# Altium schematic sheet 06_8MPLUS_IO.SchDoc: 8MPLUS_IO
size 420 x 297 mm; Author: Lukas Henkel; DocumentNumber: 6; SheetNumber: 6; SheetTotal: 16; DocSize: A3
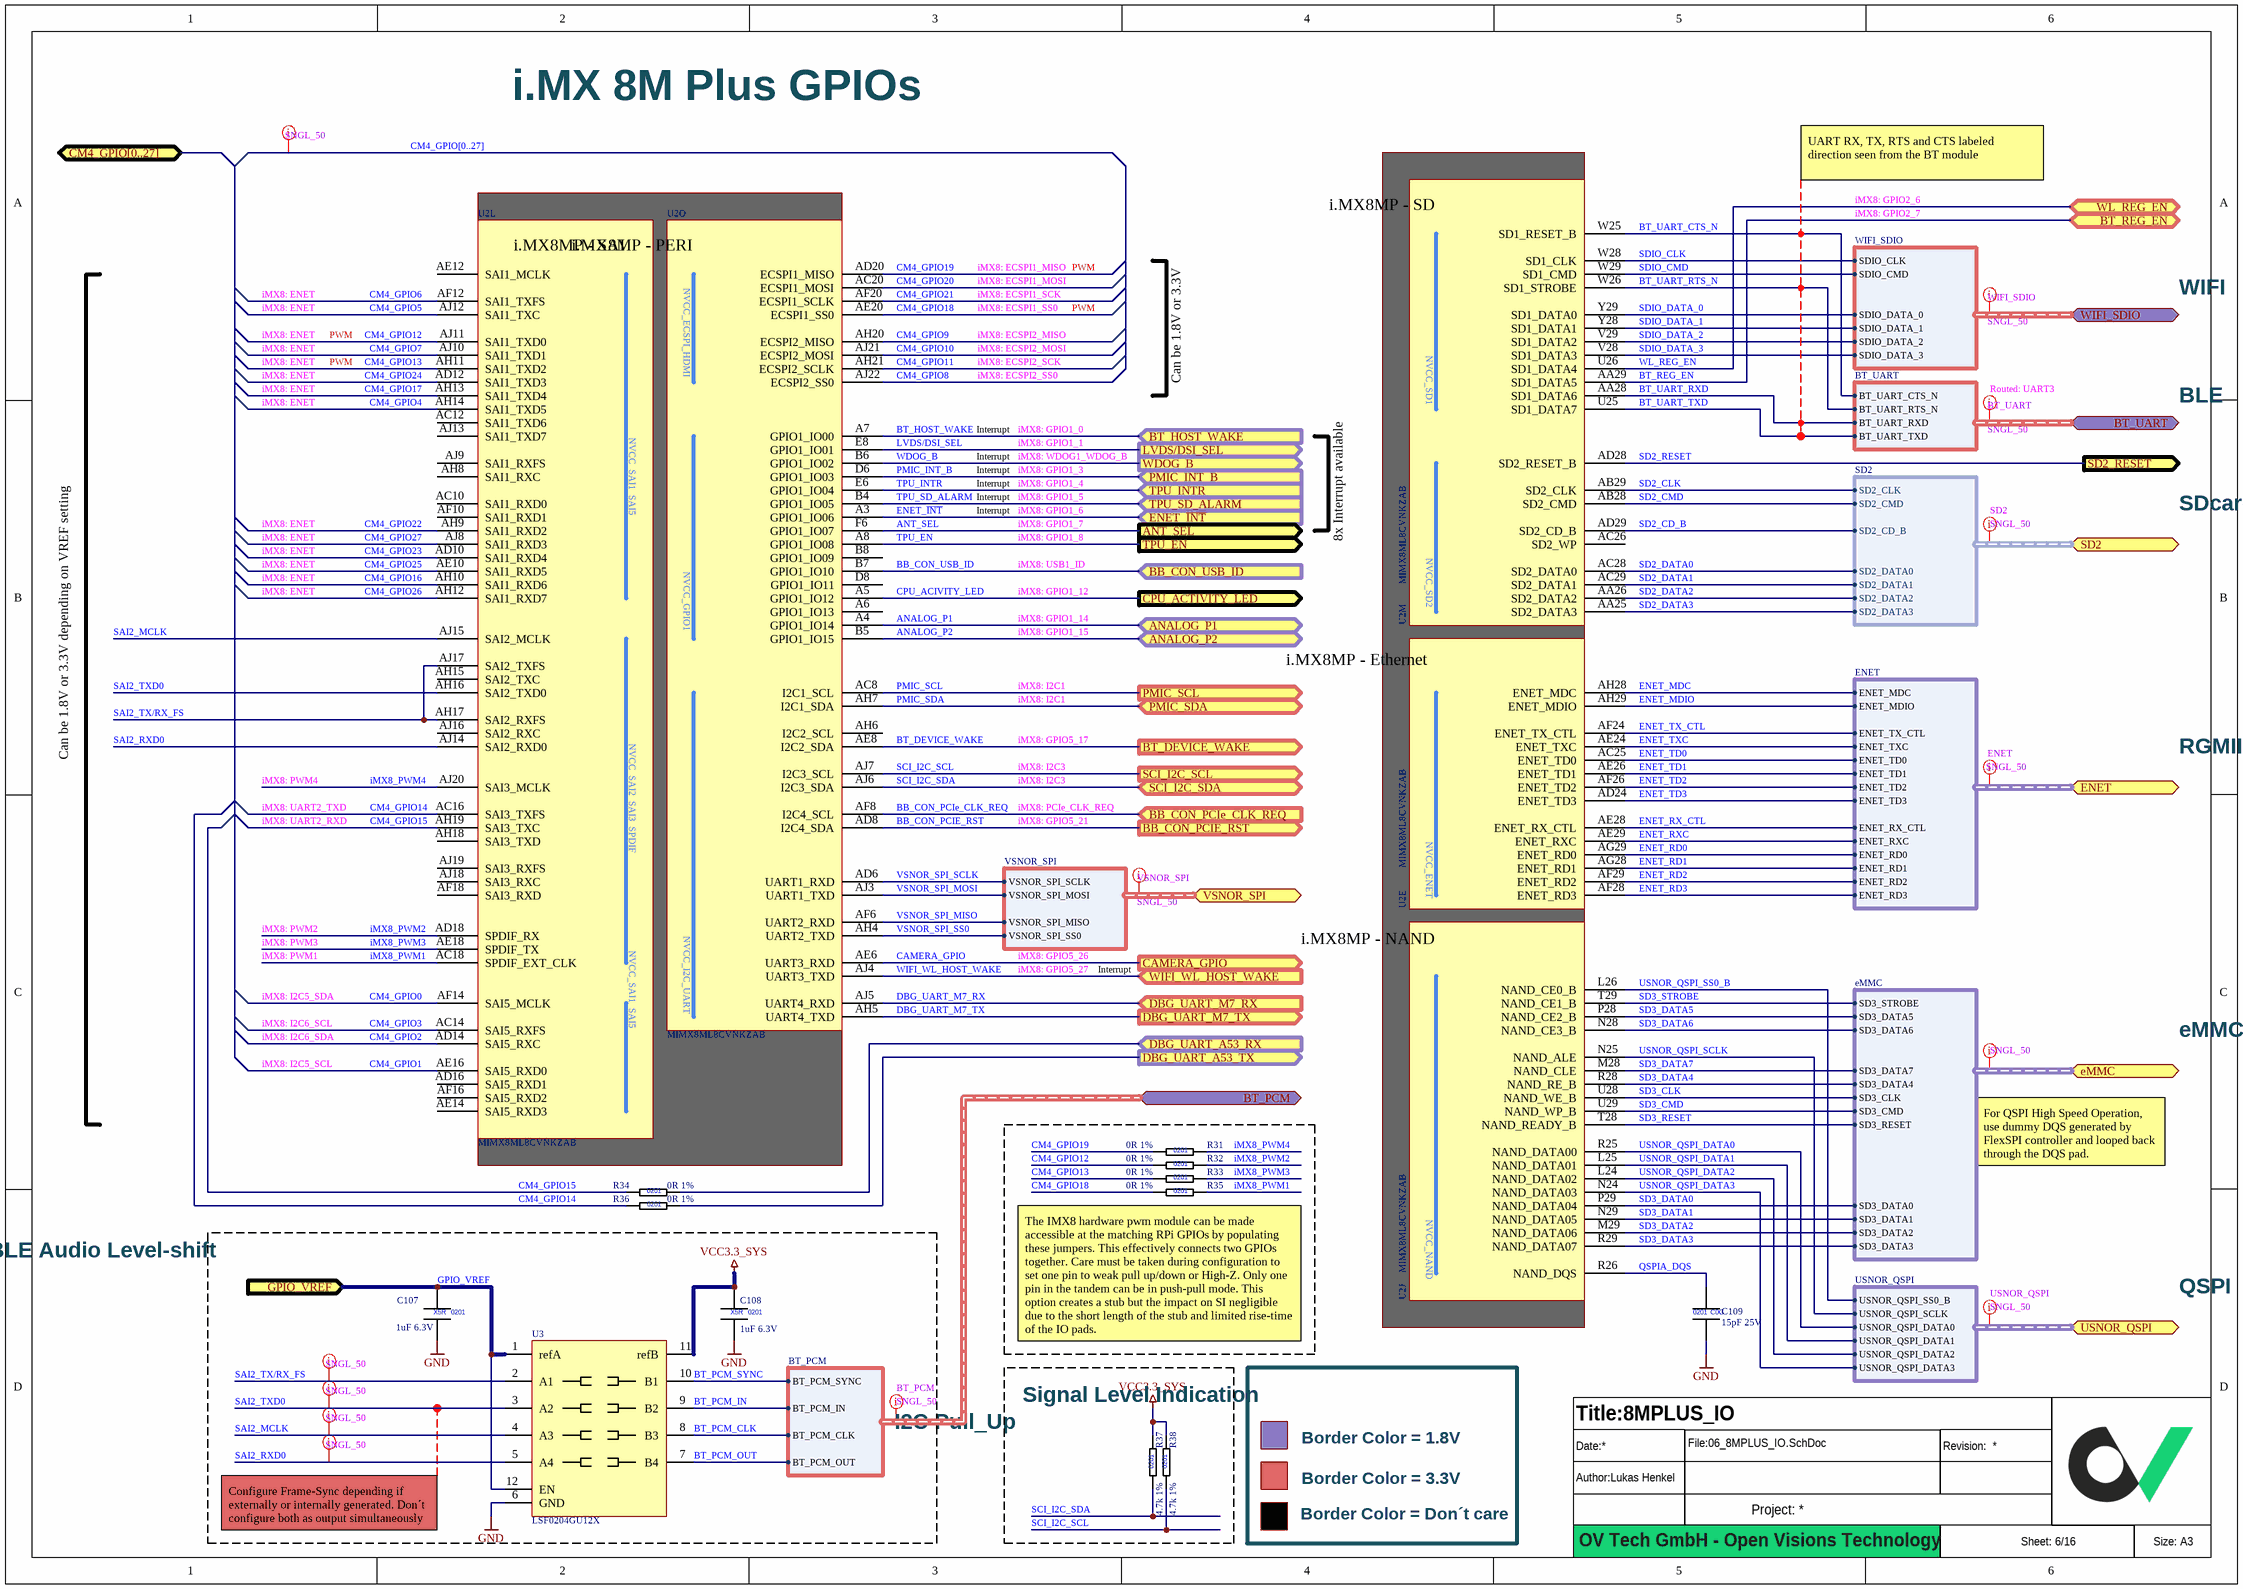
[diagram p0: 06_8MPLUS_IO.SchDoc]

## Parts
?  (no value)  (graphical)
C107  1uF 6.3V  [CAPC0603X03L]
C108  1uF 6.3V  [CAPC0603X03L]
C109  15pF 25V  [CAPC0603X03L]
R31  0R 1%  [RESC0603X03L]
R32  0R 1%  [RESC0603X03L]
R33  0R 1%  [RESC0603X03L]
R34  0R 1%  [RESC0603X03L]
R35  0R 1%  [RESC0603X03L]
R36  0R 1%  [RESC0603X03L]
R37  4.7k 1%  [RESC0603X03L]
R38  4.7k 1%  [RESC0603X03L]
U2  MIMX8ML8CVNKZAB  [BGA548C50P29X29_1500X1500X148]  (parts E,J,L,M,O of 15)
U3  LSF0204GU12X  [QFN40P170X200X50-12L]

## Blocks framed on the sheet
BLE Audio Level-shift: C107 C108 U3
I2C Pull_Up: R37 R38

## Ports
ANALOG_P1 (bidir), ANALOG_P2 (bidir), ANT_SEL (out), BB_CON_PCIe_CLK_REQ (in), BB_CON_PCIE_RST (out), BB_CON_USB_ID (in), BT_DEVICE_WAKE (out), BT_HOST_WAKE (in), BT_PCM (bidir, harness BT_PCM), BT_REG_EN (bidir), BT_UART (bidir, harness BT_UART), CAMERA_GPIO (out), CM4_GPIO[0..27] (bidir), CPU_ACTIVITY_LED (out), DBG_UART_A53_RX (in), DBG_UART_A53_TX (out), DBG_UART_M7_RX (in), DBG_UART_M7_TX (out), eMMC (bidir, harness eMMC), ENET (bidir, harness ENET), ENET_~{INT} (in), GPIO_VREF (in), LVDS/DSI_SEL (out), PMIC_INT_B (in), PMIC_SCL (out), PMIC_SDA (bidir), SCI_I2C_SCL (out), SCI_I2C_SDA (bidir), SD2 (bidir, harness SD2), SD2_RESET (out), TPU_EN (out), TPU_INTR (in), TPU_SD_ALARM (in), USNOR_QSPI (bidir, harness USNOR_QSPI), VSNOR_SPI (bidir, harness VSNOR_SPI), WDOG_B (out), WIFI_SDIO (bidir, harness WIFI_SDIO), WIFI_WL_HOST_WAKE (in), WL_REG_EN (bidir)

## Harnesses
ENET: ENET_MDC, ENET_MDIO, ENET_TX_CTL, ENET_TXC, ENET_TD0, ENET_TD1, ENET_TD2, ENET_TD3, ENET_RX_CTL, ENET_RXC, ENET_RD0, ENET_RD1, ENET_RD2, ENET_RD3
SD2: SD2_CLK, SD2_CMD, SD2_CD_B, SD2_DATA0, SD2_DATA1, SD2_DATA2, SD2_DATA3
WIFI_SDIO: SDIO_DATA_1, SDIO_DATA_0, SDIO_DATA_3, SDIO_DATA_2, SDIO_CMD, SDIO_CLK
BT_UART: BT_UART_TXD, BT_UART_RXD, BT_UART_RTS_N, BT_UART_CTS_N
BT_PCM: BT_PCM_SYNC, BT_PCM_IN, BT_PCM_OUT, BT_PCM_CLK
eMMC: SD3_STROBE, SD3_CLK, SD3_CMD, SD3_DATA0, SD3_DATA1, SD3_DATA2, SD3_DATA3, SD3_DATA4, SD3_DATA5, SD3_DATA6, SD3_DATA7, SD3_RESET
USNOR_QSPI: USNOR_QSPI_SCLK, USNOR_QSPI_SS0_B, USNOR_QSPI_DATA0, USNOR_QSPI_DATA1, USNOR_QSPI_DATA2, USNOR_QSPI_DATA3
VSNOR_SPI: VSNOR_SPI_SS0, VSNOR_SPI_SCLK, VSNOR_SPI_MOSI, VSNOR_SPI_MISO

## Nets
GND: C107.2 C108.2 C109.2 U3.6(GND)
VCC3.3_SYS: C108.1 R37.2 R38.2 U3.11(refB)
ANALOG_P1: U2.A4(GPIO1_IO14) ; port ANALOG_P1
ANALOG_P2: U2.B5(GPIO1_IO15) ; port ANALOG_P2
ANT_SEL: U2.F6(GPIO1_IO07) ; port ANT_SEL
BB_CON_PCIe_CLK_REQ: U2.AF8(I2C4_SCL) ; port BB_CON_PCIe_CLK_REQ
BB_CON_PCIE_RST: U2.AD8(I2C4_SDA) ; port BB_CON_PCIE_RST
BB_CON_USB_ID: U2.B7(GPIO1_IO10) ; port BB_CON_USB_ID
BT_DEVICE_WAKE: U2.AE8(I2C2_SDA) ; port BT_DEVICE_WAKE
BT_HOST_WAKE: U2.A7(GPIO1_IO00) ; port BT_HOST_WAKE
BT_PCM_CLK: U3.8(B3) ; port BT_PCM.BT_PCM_CLK
BT_PCM_IN: U3.9(B2) ; port BT_PCM.BT_PCM_IN
BT_PCM_OUT: U3.7(B4) ; port BT_PCM.BT_PCM_OUT
BT_PCM_SYNC: U3.10(B1) ; port BT_PCM.BT_PCM_SYNC
BT_REG_EN: U2.AA29(SD1_DATA5) ; port BT_REG_EN
BT_UART_CTS_N: U2.W25(SD1_RESET_B) ; port BT_UART.BT_UART_CTS_N
BT_UART_RTS_N: U2.W26(SD1_STROBE) ; port BT_UART.BT_UART_RTS_N
BT_UART_RXD: U2.AA28(SD1_DATA6) ; port BT_UART.BT_UART_RXD
BT_UART_TXD: U2.U25(SD1_DATA7) ; port BT_UART.BT_UART_TXD
CAMERA_GPIO: U2.AE6(UART3_RXD) ; port CAMERA_GPIO
CM4_GPIO0: U2.AF14(SAI5_MCLK)
CM4_GPIO1: U2.AE16(SAI5_RXD0)
CM4_GPIO2: U2.AD14(SAI5_RXC)
CM4_GPIO3: U2.AC14(SAI5_RXFS)
CM4_GPIO4: U2.AH14(SAI1_TXD5)
CM4_GPIO5: U2.AJ12(SAI1_TXC)
CM4_GPIO6: U2.AF12(SAI1_TXFS)
CM4_GPIO7: U2.AJ10(SAI1_TXD1)
CM4_GPIO8: U2.AJ22(ECSPI2_SS0)
CM4_GPIO9: U2.AH20(ECSPI2_MISO)
CM4_GPIO10: U2.AJ21(ECSPI2_MOSI)
CM4_GPIO11: U2.AH21(ECSPI2_SCLK)
CM4_GPIO12: R32.1 U2.AJ11(SAI1_TXD0)
CM4_GPIO13: R33.1 U2.AH11(SAI1_TXD2)
CM4_GPIO14: R36.1 U2.AC16(SAI3_TXFS)
CM4_GPIO15: R34.1 U2.AH19(SAI3_TXC)
CM4_GPIO16: U2.AH10(SAI1_RXD6)
CM4_GPIO17: U2.AH13(SAI1_TXD4)
CM4_GPIO18: R35.1 U2.AE20(ECSPI1_SS0)
CM4_GPIO19: R31.1 U2.AD20(ECSPI1_MISO)
CM4_GPIO20: U2.AC20(ECSPI1_MOSI)
CM4_GPIO21: U2.AF20(ECSPI1_SCLK)
CM4_GPIO22: U2.AH9(SAI1_RXD2)
CM4_GPIO23: U2.AD10(SAI1_RXD4)
CM4_GPIO24: U2.AD12(SAI1_TXD3)
CM4_GPIO25: U2.AE10(SAI1_RXD5)
CM4_GPIO26: U2.AH12(SAI1_RXD7)
CM4_GPIO27: U2.AJ8(SAI1_RXD3)
CPU_ACIVITY_LED: U2.A5(GPIO1_IO12) ; port CPU_ACTIVITY_LED
DBG_UART_A53_RX: R34.2 ; port DBG_UART_A53_RX
DBG_UART_A53_TX: R36.2 ; port DBG_UART_A53_TX
DBG_UART_M7_RX: U2.AJ5(UART4_RXD) ; port DBG_UART_M7_RX
DBG_UART_M7_TX: U2.AH5(UART4_TXD) ; port DBG_UART_M7_TX
ENET_~{INT}: U2.A3(GPIO1_IO06) ; port ENET_~{INT}
ENET_MDC: U2.AH28(ENET_MDC) ; port ENET.ENET_MDC
ENET_MDIO: U2.AH29(ENET_MDIO) ; port ENET.ENET_MDIO
ENET_RD0: U2.AG29(ENET_RD0) ; port ENET.ENET_RD0
ENET_RD1: U2.AG28(ENET_RD1) ; port ENET.ENET_RD1
ENET_RD2: U2.AF29(ENET_RD2) ; port ENET.ENET_RD2
ENET_RD3: U2.AF28(ENET_RD3) ; port ENET.ENET_RD3
ENET_RX_CTL: U2.AE28(ENET_RX_CTL) ; port ENET.ENET_RX_CTL
ENET_RXC: U2.AE29(ENET_RXC) ; port ENET.ENET_RXC
ENET_TD0: U2.AC25(ENET_TD0) ; port ENET.ENET_TD0
ENET_TD1: U2.AE26(ENET_TD1) ; port ENET.ENET_TD1
ENET_TD2: U2.AF26(ENET_TD2) ; port ENET.ENET_TD2
ENET_TD3: U2.AD24(ENET_TD3) ; port ENET.ENET_TD3
ENET_TX_CTL: U2.AF24(ENET_TX_CTL) ; port ENET.ENET_TX_CTL
ENET_TXC: U2.AE24(ENET_TXC) ; port ENET.ENET_TXC
GPIO_VREF: C107.1 U3.1(refA) U3.12(EN) ; port GPIO_VREF
iMX8_PWM1: R35.2 U2.AC18(SPDIF_EXT_CLK)
iMX8_PWM2: R32.2 U2.AD18(SPDIF_RX)
iMX8_PWM3: R33.2 U2.AE18(SPDIF_TX)
iMX8_PWM4: R31.2 U2.AJ20(SAI3_MCLK)
LVDS/DSI_SEL: U2.E8(GPIO1_IO01) ; port LVDS/DSI_SEL
PMIC_INT_B: U2.D6(GPIO1_IO03) ; port PMIC_INT_B
PMIC_SCL: U2.AC8(I2C1_SCL) ; port PMIC_SCL
PMIC_SDA: U2.AH7(I2C1_SDA) ; port PMIC_SDA
QSPIA_DQS: C109.1 U2.R26(NAND_DQS)
SAI2_MCLK: U2.AJ15(SAI2_MCLK) U3.4(A3)
SAI2_RXD0: U2.AJ14(SAI2_RXD0) U3.5(A4)
SAI2_TX/RX_FS: U2.AH17(SAI2_RXFS) U2.AJ17(SAI2_TXFS) U3.2(A1)
SAI2_TXD0: U2.AH16(SAI2_TXD0) U3.3(A2)
SCI_I2C_SCL: R38.1 U2.AJ7(I2C3_SCL) ; port SCI_I2C_SCL
SCI_I2C_SDA: R37.1 U2.AJ6(I2C3_SDA) ; port SCI_I2C_SDA
SD2_CD_B: U2.AD29(SD2_CD_B) ; port SD2.SD2_CD_B
SD2_CLK: U2.AB29(SD2_CLK) ; port SD2.SD2_CLK
SD2_CMD: U2.AB28(SD2_CMD) ; port SD2.SD2_CMD
SD2_DATA0: U2.AC28(SD2_DATA0) ; port SD2.SD2_DATA0
SD2_DATA1: U2.AC29(SD2_DATA1) ; port SD2.SD2_DATA1
SD2_DATA2: U2.AA26(SD2_DATA2) ; port SD2.SD2_DATA2
SD2_DATA3: U2.AA25(SD2_DATA3) ; port SD2.SD2_DATA3
SD2_RESET: U2.AD28(SD2_RESET_B) ; port SD2_RESET
SD3_CLK: U2.U28(NAND_WE_B) ; port eMMC.SD3_CLK
SD3_CMD: U2.U29(NAND_WP_B) ; port eMMC.SD3_CMD
SD3_DATA0: U2.P29(NAND_DATA04) ; port eMMC.SD3_DATA0
SD3_DATA1: U2.N29(NAND_DATA05) ; port eMMC.SD3_DATA1
SD3_DATA2: U2.M29(NAND_DATA06) ; port eMMC.SD3_DATA2
SD3_DATA3: U2.R29(NAND_DATA07) ; port eMMC.SD3_DATA3
SD3_DATA4: U2.R28(NAND_RE_B) ; port eMMC.SD3_DATA4
SD3_DATA5: U2.P28(NAND_CE2_B) ; port eMMC.SD3_DATA5
SD3_DATA6: U2.N28(NAND_CE3_B) ; port eMMC.SD3_DATA6
SD3_DATA7: U2.M28(NAND_CLE) ; port eMMC.SD3_DATA7
SD3_RESET: U2.T28(NAND_READY_B) ; port eMMC.SD3_RESET
SD3_STROBE: U2.T29(NAND_CE1_B) ; port eMMC.SD3_STROBE
SDIO_CLK: U2.W28(SD1_CLK) ; port WIFI_SDIO.SDIO_CLK
SDIO_CMD: U2.W29(SD1_CMD) ; port WIFI_SDIO.SDIO_CMD
SDIO_DATA_0: U2.Y29(SD1_DATA0) ; port WIFI_SDIO.SDIO_DATA_0
SDIO_DATA_1: U2.Y28(SD1_DATA1) ; port WIFI_SDIO.SDIO_DATA_1
SDIO_DATA_2: U2.V29(SD1_DATA2) ; port WIFI_SDIO.SDIO_DATA_2
SDIO_DATA_3: U2.V28(SD1_DATA3) ; port WIFI_SDIO.SDIO_DATA_3
TPU_EN: U2.A8(GPIO1_IO08) ; port TPU_EN
TPU_INTR: U2.E6(GPIO1_IO04) ; port TPU_INTR
TPU_SD_ALARM: U2.B4(GPIO1_IO05) ; port TPU_SD_ALARM
USNOR_QSPI_DATA0: U2.R25(NAND_DATA00) ; port USNOR_QSPI.USNOR_QSPI_DATA0
USNOR_QSPI_DATA1: U2.L25(NAND_DATA01) ; port USNOR_QSPI.USNOR_QSPI_DATA1
USNOR_QSPI_DATA2: U2.L24(NAND_DATA02) ; port USNOR_QSPI.USNOR_QSPI_DATA2
USNOR_QSPI_DATA3: U2.N24(NAND_DATA03) ; port USNOR_QSPI.USNOR_QSPI_DATA3
USNOR_QSPI_SCLK: U2.N25(NAND_ALE) ; port USNOR_QSPI.USNOR_QSPI_SCLK
USNOR_QSPI_SS0_B: U2.L26(NAND_CE0_B) ; port USNOR_QSPI.USNOR_QSPI_SS0_B
VSNOR_SPI_MISO: U2.AF6(UART2_RXD) ; port VSNOR_SPI.VSNOR_SPI_MISO
VSNOR_SPI_MOSI: U2.AJ3(UART1_TXD) ; port VSNOR_SPI.VSNOR_SPI_MOSI
VSNOR_SPI_SCLK: U2.AD6(UART1_RXD) ; port VSNOR_SPI.VSNOR_SPI_SCLK
VSNOR_SPI_SS0: U2.AH4(UART2_TXD) ; port VSNOR_SPI.VSNOR_SPI_SS0
WDOG_B: U2.B6(GPIO1_IO02) ; port WDOG_B
WIFI_WL_HOST_WAKE: U2.AJ4(UART3_TXD) ; port WIFI_WL_HOST_WAKE
WL_REG_EN: U2.U26(SD1_DATA4) ; port WL_REG_EN

Not connected (* = marked no-connect by the designer): U2 A6(GPIO1_IO13) AC10(SAI1_RXD0) AC12(SAI1_TXD6) AC26(SD2_WP) AD16(SAI5_RXD1) AE12(SAI1_MCLK) AE14(SAI5_RXD3) AF10(SAI1_RXD1) AF16(SAI5_RXD2) AF18(SAI3_RXD) AH6(I2C2_SCL) AH8(SAI1_RXC) AH15(SAI2_TXC) AH18(SAI3_TXD) AJ9(SAI1_RXFS) AJ13(SAI1_TXD7) AJ16(SAI2_RXC) AJ18(SAI3_RXC) AJ19(SAI3_RXFS) B8(GPIO1_IO09) D8(GPIO1_IO11)

## Buses and harness runs
bus CM4_GPIO[0..27] = port CM4_GPIO[0..27]

## Layout directives
net class ENET; net class SNGL_50: (no net found under the mark)
net class SD2; net class SNGL_50: (no net found under the mark)
net class WIFI_SDIO; net class SNGL_50: (no net found under the mark)
net class BT_UART; net class SNGL_50: (no net found under the mark)
net class BT_PCM; net class SNGL_50: (no net found under the mark)
net class SNGL_50: (no net found under the mark), SAI2_MCLK, SAI2_RXD0, SAI2_TX/RX_FS, SAI2_TXD0
net class USNOR_QSPI; net class SNGL_50: (no net found under the mark)
net class VSNOR_SPI; net class SNGL_50: (no net found under the mark)

## Notes on the sheet
- i.MX 8M Plus GPIOs
- UART RX, TX, RTS and CTS labeled direction seen from the BT module
- iMX8: GPIO2_7
- iMX8: GPIO2_6
- iMX8: ENET
- iMX8: ECSPI1_MISO
- iMX8: ECSPI1_MOSI
- iMX8: ECSPI1_SCK
- iMX8: ECSPI1_SS0
- PWM
- WIFI
- iMX8: ECSPI2_MISO
- iMX8: ECSPI2_MOSI
- iMX8: ECSPI2_SCK
- iMX8: ECSPI2_SS0
- Can be 1.8V or 3.3V
- Routed: UART3
- Interrupt
- iMX8: WDOG1_WDOG_B
- iMX8: GPIO1_1
- iMX8: GPIO1_0
- BLE
- iMX8: GPIO1_3
- iMX8: GPIO1_4
- iMX8: GPIO1_5
- iMX8: GPIO1_6
- iMX8: GPIO1_7
- SDcard external
- iMX8: USB1_ID
- iMX8: GPIO1_12
- iMX8: GPIO1_8
- 8x Interrupt available
- iMX8: GPIO1_14
- iMX8: GPIO1_15
- iMX8: I2C1
- Can be 1.8V or 3.3V depending on VREF setting
- iMX8: PWM4
- iMX8: GPIO5_17
- iMX8: I2C3
- RGMII
- iMX8: UART2_RXD
- iMX8: UART2_TXD
- iMX8: GPIO5_21
- iMX8: PCIe_CLK_REQ
- iMX8: PWM2
- Routed: ECSPI3
- iMX8: I2C5_SDA
- iMX8: PWM1
- iMX8: PWM3
- iMX8: GPIO5_26
- iMX8: GPIO5_27
- iMX8: I2C5_SCL
- iMX8: I2C6_SCL
- iMX8: I2C6_SDA
- eMMC
- For QSPI High Speed Operation, use dummy DQS generated by FlexSPI controller and looped back through the DQS pad.
- (near R35) The IMX8 hardware pwm module can be made accessible at the matching RPi GPIOs by populating these jumpers. This effectively connects two GPIOs together. Care must be taken during configuration to set one pin to weak pull up/down or High-Z. Only one pin in the tandem can be in push-pull mode. This option creates a stub but the impact on SI negligible due to the short length of the stub and limited rise-time of the IO pads.
- QSPI
- Signal Level Indication
- Border Color = 1.8V
- Configure Frame-Sync depending if externally or internally generated. Don´t configure both as output simultaneously
- Border Color = Don´t care
- Border Color = 3.3V
- OV Tech GmbH - Open Visions Technology
- (in symbol CAP_0201_1uF_6.3V) X5R; 0201
- (in symbol CAP_0201_15pF_25V) 0201; C0G
- (in symbol RES_0201_0R_1%) 0201
- (in symbol RES_0201_4.7k_1%) 0201
- (in symbol SoC_i.MX 8M Plus_Quad, part E) i.MX8MP - Ethernet
- (in symbol SoC_i.MX 8M Plus_Quad, part J) i.MX8MP - NAND
- (in symbol SoC_i.MX 8M Plus_Quad, part L) i.MX8MP - SAI
- (in symbol SoC_i.MX 8M Plus_Quad, part M) i.MX8MP - SD
- (in symbol SoC_i.MX 8M Plus_Quad, part O) i.MX8MP - PERI; NVCC_GPIO1

## Library data of the parts
? = Titleblock_01_OpenSource
C107 C108 = CAP_0201_1uF_6.3V: Multilayer Ceramic Capacitors MLCC - SMD/SMT 0201 6.3VDC; Manufacturer 1: Murata Electronics; Manufacturer 1 Prt. Nr.: GRM033R60J105MEA2D; Manufacturer 2 Prt. Nr.: CL03A105MQ3CSNC; Manufacturer 2: Samsung Electro-Mechanics
C109 = CAP_0201_15pF_25V: Multilayer Ceramic Capacitors MLCC - SMD/SMT 0201 25VDC; Manufacturer 1: Murata Electronics; Manufacturer 1 Prt. Nr.: GCM0335C1E150FA16J; Manufacturer 2 Prt. Nr.: C0201C150J3GACTU; Manufacturer 2: KEMET
R31-R36 = RES_0201_0R_1%: Thick Film Resistors - SMD 0R OHM 1%; Manufacturer 1: Yageo; Manufacturer 1 Prt. Nr.: RC0201FR-070RL; Manufacturer 2 Prt. Nr.: CRCW02010000Z0ED; Manufacturer 2: Vishay / Dale
R37 R38 = RES_0201_4.7k_1%: Thick Film Resistors - SMD 4.7K OHM 1%; Manufacturer 1: Yageo; Manufacturer 1 Prt. Nr.: RC0201JR-074K7P; Manufacturer 2 Prt. Nr.: CRCW02014K70FNED; Manufacturer 2: Vishay / Dale
U2 = SoC_i.MX 8M Plus_Quad: i.MX 8M Plus Applications Processor  for Industrial Products; Manufacturer 1: NXP Semiconductor; Manufacturer 1 Prt. Nr.: MIMX8ML8CVNKZAB
U3 = Quad_Bidirectional_LvL Shift_LSF0204GU12X: 4-bit bidirectional multi-voltage level translator; Manufacturer 1: Nexperia; Manufacturer 1 Prt. Nr.: LSF0204GU12X; Temperature Range: -40°C - 125°C